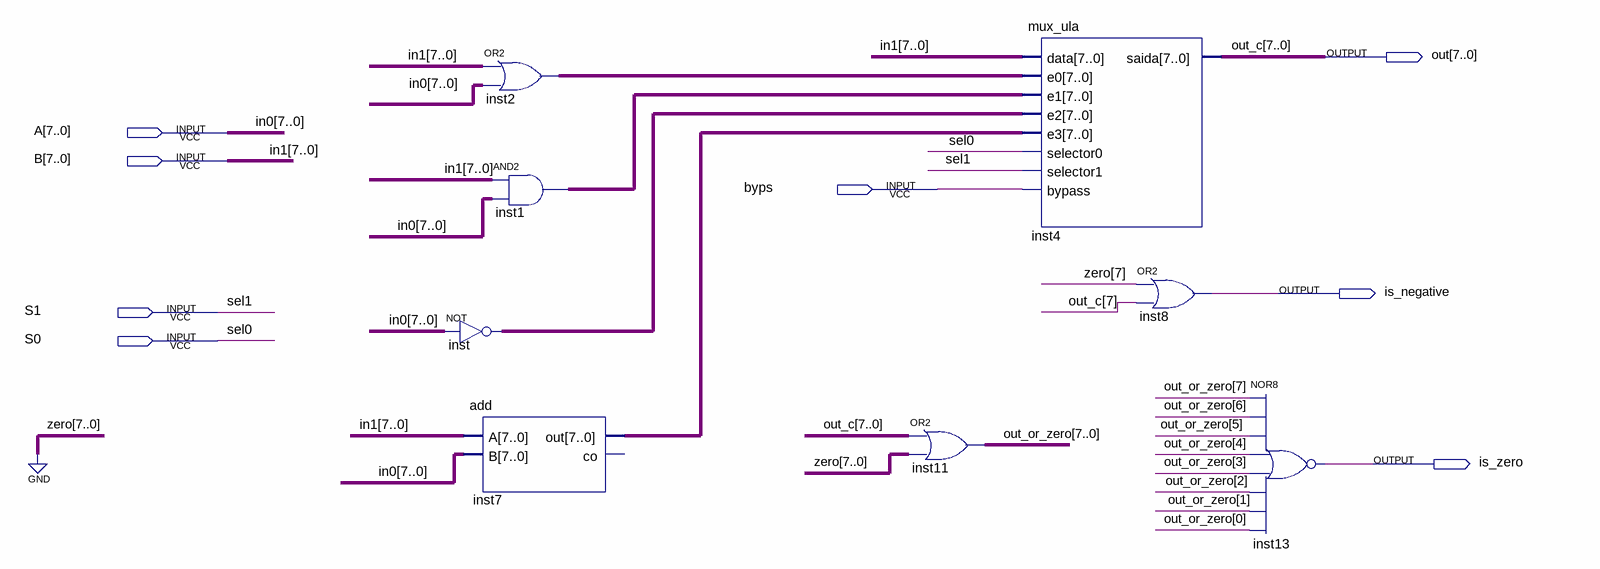
[diagram p0: schematic sheet]
// Quartus schematic ula.bdf as structural Verilog: 8 symbols, 8 pins
module ula (
  input  [7:0] A,
  input  [7:0] B,
  input  byps,
  input  S1,
  input  S0,
  output [7:0] out,
  output is_negative,
  output is_zero
);

  wire [7:0] inst1_out, inst2_out, inst7_out, inst_out, out_or_zero;

  assign inst2_out = B | A;  // OR2 inst2, 8 bits wide
  assign inst1_out = B & A;  // AND2 inst1, 8 bits wide
  assign inst_out = ~A;  // NOT inst, 8 bits wide
  add inst7 (.A(B), .B(A), .out(inst7_out));  // open: co
  assign out_or_zero = out | {8{1'b0}};  // OR2 inst11, 8 bits wide
  mux_ula inst4 (
    .data(B), .e0(inst2_out), .e1(inst1_out), .e2(inst_out), .e3(inst7_out), .selector0(S0), .selector1(S1),
    .bypass(byps), .saida(out));
  or inst8 (is_negative, 1'b0, out[7]);
  nor inst13 (is_zero, out_or_zero[7], out_or_zero[6], out_or_zero[5], out_or_zero[4], out_or_zero[3], out_or_zero[2], out_or_zero[1], out_or_zero[0]);

  // Other names for the same wires on the sheet: in0[7:0] = A; in1[7:0] = B; out_c[7:0] = out; sel0 = S0; sel1 = S1
endmodule
